# Altium schematic sheet device-bspd.SchDoc
size 297 x 209 mm
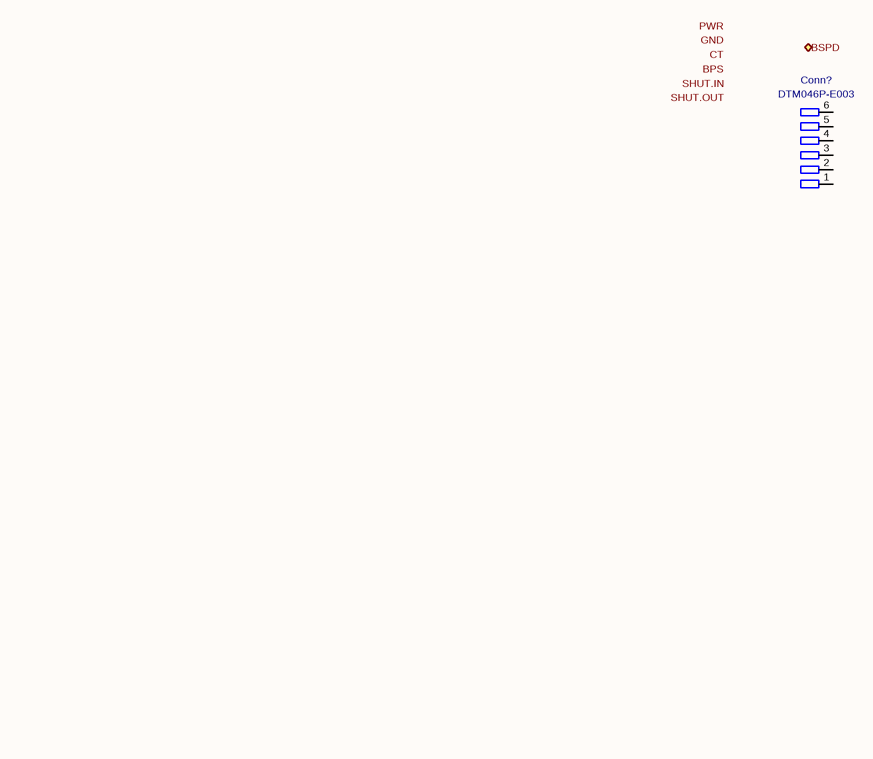
[diagram p0: device-bspd.SchDoc]

## Parts
Conn?  P/N: DTM046P-E003  (hidden comment: Deutsch_DTM_6P_Pin)

## Ports
BSPD (bidir)

## Nets

Not connected (* = marked no-connect by the designer): Conn? 1 2 3 4 5 6

## Notes on the sheet
- Labels drawn without touching a wire or pin: BPS, CT, GND, PWR, SHUT.IN, SHUT.OUT
- 1
- 2
- 3
- 4
- 5
- 6
- A
- B
- C
- D
- Title: DEVICE - BSPD
- File: device-bspd.kicad_sch
- Sheet: /
- KiCad E.D.A.  kicad (5.1.4)-1
- Size: A4
- Date:
- Rev:
- Id: 1/1

## Library data of the parts
Conn? = Deutsch_DTM_6P_Pin: Value: Deutsch_DTM_6P_Pin